# EAGLE design golia (EAGLE 8.1.1)
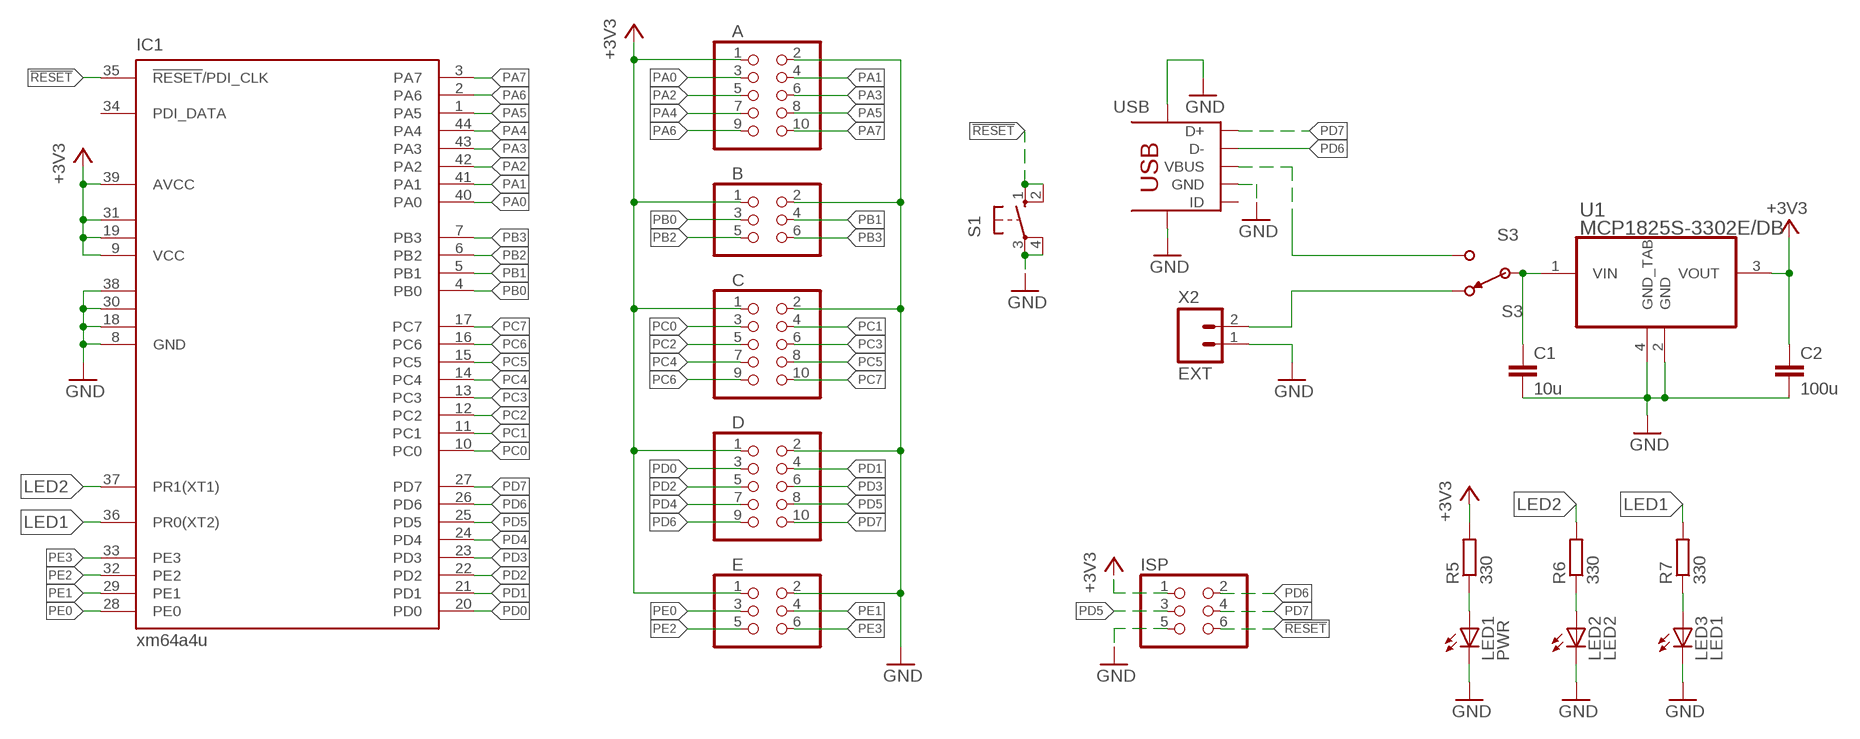
[diagram p0: schematic, sheet 1]

## Parts
A  PINHD-2X5  [2X05]
B  PINHD-2X3  [2X03]
C  PINHD-2X5  [2X05]
C1  10u  C0603  [C0603]
C2  100u  C-EUC1206  [C1206]
D  PINHD-2X5  [2X05]
E  PINHD-2X3  [2X03]
IC1  xm64a4u  XMEGA16A4A  [TQFP44]
ISP  PINHD-2X3  [2X03]
LED1  PWR  LEDCHIP-LED0805  [CHIP-LED0805]
LED2  LED2  LEDCHIP-LED0805  [CHIP-LED0805]
LED3  LED1  LEDCHIP-LED0805  [CHIP-LED0805]
R5  330  R-EU_R0603  [R0603]
R6  330  R-EU_R0603  [R0603]
R7  330  R-EU_R0603  [R0603]
S1  10-XX  [B3F-10XX]
S3  S3  SPDTEG-1218  [EG-1218]
U1  MCP1825S-3302E/DB  [SOT230P700X180-4N]
USB  USB-MINIB-PTH  [USB-MINIB-PTH]
X2  EXT  JST-22MM-PTH-VERT-LOCK  [JST-2-2MM-PTH-VERT-LOCK]

## Nets
!RESET: IC1.35(!RESET!/PDI_CLK) ISP.6 S1.1(S) S1.2(S1)
+3V3: A.1 B.1 C2.1 C.1 D.1 E.1 IC1.9(VCC) IC1.19(VCC1) IC1.31(VCC2) IC1.39(AVCC) ISP.1 R5.2 U1.3(VOUT)
GND: A.2 B.2 C1.2 C2.2 C.2 D.2 E.2 IC1.8(GND) IC1.18(GND1) IC1.30(GND2) IC1.38(GND3) ISP.5 LED1.C LED2.C LED3.C S1.3(P) S1.4(P1) U1.2(GND) U1.4(GND_TAB) USB.GND USB.P$6(SHD1) USB.P$7(SHD2) X2.1
LED1: IC1.36(PR0(XT2)) R7.2
LED2: IC1.37(PR1(XT1)) R6.2
N$1: S3.1 X2.2
N$2: S3.3 USB.VBUS
N$5: C1.1 S3.2(C) U1.1(VIN)
N$8: LED1.A R5.1
N$9: LED2.A R6.1
N$10: LED3.A R7.1
PA0: A.3 IC1.40(PA0)
PA1: A.4 IC1.41(PA1)
PA2: A.5 IC1.42(PA2)
PA3: A.6 IC1.43(PA3)
PA4: A.7 IC1.44(PA4)
PA5: A.8 IC1.1(PA5)
PA6: A.9 IC1.2(PA6)
PA7: A.10 IC1.3(PA7)
PB0: B.3 IC1.4(PB0)
PB1: B.4 IC1.5(PB1)
PB2: B.5 IC1.6(PB2)
PB3: B.6 IC1.7(PB3)
PC0: C.3 IC1.10(PC0)
PC1: C.4 IC1.11(PC1)
PC2: C.5 IC1.12(PC2)
PC3: C.6 IC1.13(PC3)
PC4: C.7 IC1.14(PC4)
PC5: C.8 IC1.15(PC5)
PC6: C.9 IC1.16(PC6)
PC7: C.10 IC1.17(PC7)
PD0: D.3 IC1.20(PD0)
PD1: D.4 IC1.21(PD1)
PD2: D.5 IC1.22(PD2)
PD3: D.6 IC1.23(PD3)
PD4: D.7 IC1.24(PD4)
PD5: D.8 IC1.25(PD5) ISP.3
PD6: D.9 IC1.26(PD6) ISP.2 USB.D-
PD7: D.10 IC1.27(PD7) ISP.4 USB.D+
PE0: E.3 IC1.28(PE0)
PE1: E.4 IC1.29(PE1)
PE2: E.5 IC1.32(PE2)
PE3: E.6 IC1.33(PE3)
Unconnected: IC1.34(PDI_DATA) USB.ID

## Library data of the parts
A C D = pinhead:PINHD-2X5: PIN HEADER
B E ISP = pinhead:PINHD-2X3: PIN HEADER
C1 = Passives:C; SUPPLIER: Onecall; TYPE: Capacitor
C2 = rcl:C-EU: CAPACITOR, European symbol
IC1 = atmel:XMEGA16A4: MICROCONTROLLER Features High-performance, Low-power 8/16-bit AVR XMEGA Microcontroller Non-Volatile Program and Data Memories - 16 KB - 128 KB of In-System Self-Programmable Flash - 4 KB - 8 KB Boot Code Section with Independent Lock Bits - 1 KB - 2 KB EEPROM - 2 KB - 8 KB Internal SRAM Peripheral Features - Four-channel DMA Controller with support for external requests - Eight-channel Event System - Five 16-bit Timer/Counters Three Timer/Counters with 4 Output Compare or Input Capture channels Two Timer/Counters with 2 Output Compare or Input Capture channels High-Resolution Extensions on all Timer/Counters Advanced Waveform Extension on one Timer/Counter - Five USARTs IrDA Extension on one USART - Two Two-Wire Interfaces with dual address match (I2C and SMBus compatible) - Two SPIs (Serial Peripheral Interfaces) peripherals - AES and DES Crypto Engine - 16-bit Real Time Counter with Separate Oscillator - One Twelve-channel, 12-bit, 2 Msps Analog to Digital Converter - One Two-channel, 12-bit, 1 Msps Digital to Analog Converter - Two Analog Comparators with Window compare function - External Interrupts on all General Purpose I/O pins - Programmable Watchdog Timer with Separate On-chip Ultra Low Power Oscillator Special Microcontroller Features - Power-on Reset and Programmable Brown-out Detection - Internal and External Clock Options with PLL - Programmable Multi-level Interrupt Controller - Sleep Modes: Idle, Power-down, Standby, Power-save, Extended Standby - Advanced Programming, Test and Debugging Interfaces PDI (Program and Debug Interface) for programming, test and debugging I/O and Packages - 34 Programmable I/O Lines - 44 - lead TQFP - 44 - pad VQFN/QFN - 49 - ball VFBGA Operating Voltage - 1.6 - 3.6V Speed performance - 0 - 12 MHz @ 1.6 - 3.6V - 0 - 32 MHz @ 2.7 - 3.6V Drawn by Dipl.-Ing. (FH) Robert Siegler Created: 27.05.09; OC_FARNELL: unknown; OC_NEWARK: unknown
LED1-LED3 = led:LED: LED OSRAM: - CHIPLED LG R971, LG N971, LY N971, LG Q971, LY Q971, LO R971, LY R971 LH N974, LH R974 LS Q976, LO Q976, LY Q976 LO Q996 - Hyper CHIPLED LW Q18S LB Q993, LB Q99A, LB R99A - SideLED LS A670, LO A670, LY A670, LG A670, LP A670 LB A673, LV A673, LT A673, LW A673 LH A674 LY A675 LS A676, LA A676, LO A676, LY A676, LW A676 LS A679, LY A679, LG A679 - Hyper Micro SIDELED® LS Y876, LA Y876, LO Y876, LY Y876 LT Y87S - SmartLED LW L88C, LW L88S LB L89C, LB L89S, LG L890 LS L89K, LO L89K, LY L89K LS L896, LA L896, LO L896, LY L896 - TOPLED LS T670, LO T670, LY T670, LG T670, LP T670 LSG T670, LSP T670, LSY T670, LOP T670, LYG T670 LG T671, LOG T671, LSG T671 LB T673, LV T673, LT T673, LW T673 LH T674 LS T676, LA T676, LO T676, LY T676, LB T676, LH T676, LSB T676, LW T676 LB T67C, LV T67C, LT T67C, LS T67K, LO T67K, LY T67K, LW E67C LS E67B, LA E67B, LO E67B, LY E67B, LB E67C, LV E67C, LT E67C LW T67C LS T679, LY T679, LG T679 LS T770, LO T770, LY T770, LG T770, LP T770 LB T773, LV T773, LT T773, LW T773 LH T774 LS E675, LA E675, LY E675, LS T675 LS T776, LA T776, LO T776, LY T776, LB T776 LHGB T686 LT T68C, LB T68C - Hyper Mini TOPLED® LB M676 - Mini TOPLED Santana® LG M470 LS M47K, LO M47K, LY M47K Source: http://www.osram.convergy.de LUXEON: - LUMILED® LXK2-PW12-R00, LXK2-PW12-S00, LXK2-PW14-U00, LXK2-PW14-V00 LXK2-PM12-R00, LXK2-PM12-S00, LXK2-PM14-U00 LXK2-PE12-Q00, LXK2-PE12-R00, LXK2-PE12-S00, LXK2-PE14-T00, LXK2-PE14-U00 LXK2-PB12-K00, LXK2-PB12-L00, LXK2-PB12-M00, LXK2-PB14-N00, LXK2-PB14-P00, LXK2-PB14-Q00 LXK2-PR12-L00, LXK2-PR12-M00, LXK2-PR14-Q00, LXK2-PR14-R00 LXK2-PD12-Q00, LXK2-PD12-R00, LXK2-PD12-S00 LXK2-PH12-R00, LXK2-PH12-S00 LXK2-PL12-P00, LXK2-PL12-Q00, LXK2-PL12-R00 Source: www.luxeon.com KINGBRIGHT: KA-3528ASYC Source: www.kingbright.com
R5-R7 = rcl:R-EU_: RESISTOR, European symbol
S1 = switch-omron:10-XX: OMRON SWITCH; MPN: B3F-1000; OC_FARNELL: 176432; OC_NEWARK: 36M3542
S3 = Switches:SPDT
U1 = mcp1825:MCP1825S-3302E/DB: IC, LDO VOLT REG, 3.3V, 0.5A; MPN: MCP1825S-3302E/DB; OC_FARNELL: 1578404; OC_NEWARK: 26M9961; PACKAGE: SOT-223-3; SUPPLIER: Microchip
USB = Connectors:USB-MINI
X2 = Connectors:JST-2

## Board
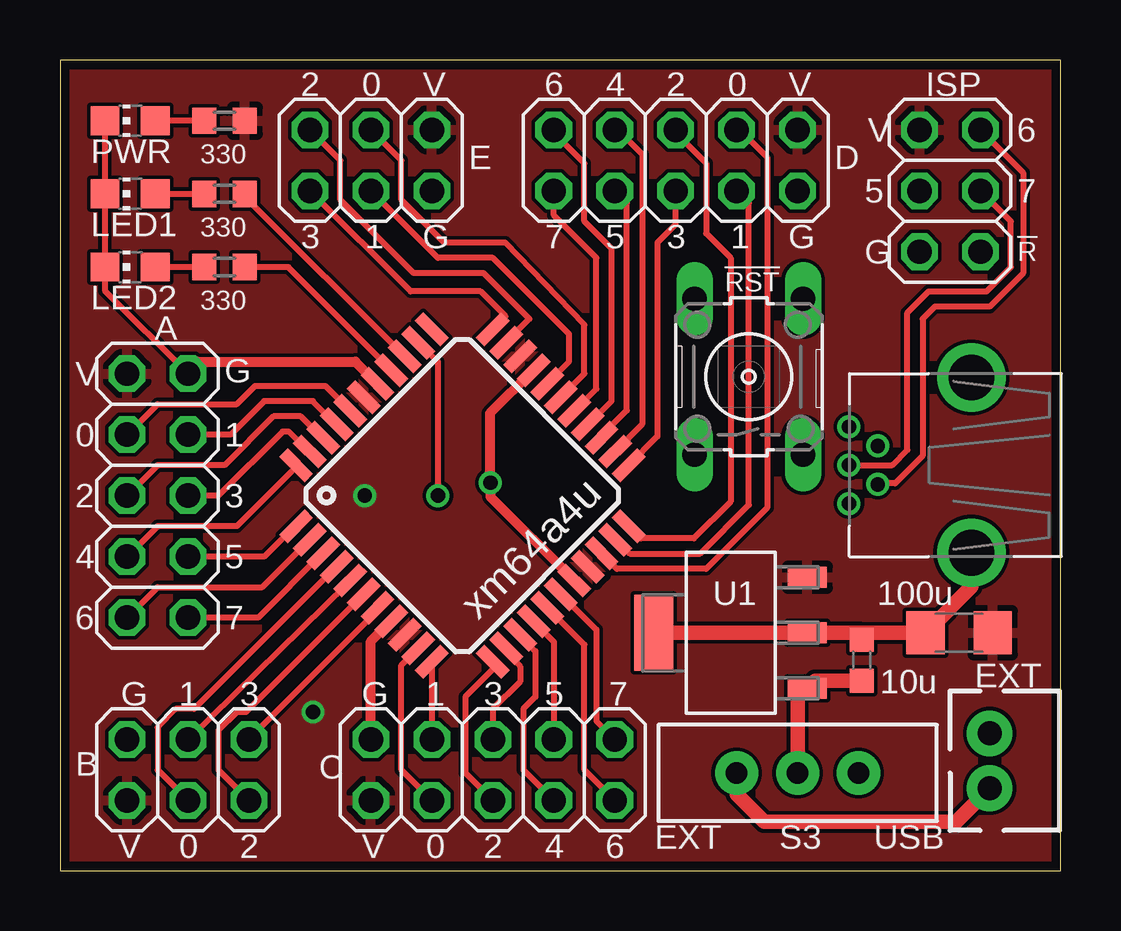
[diagram p1: board, top side]
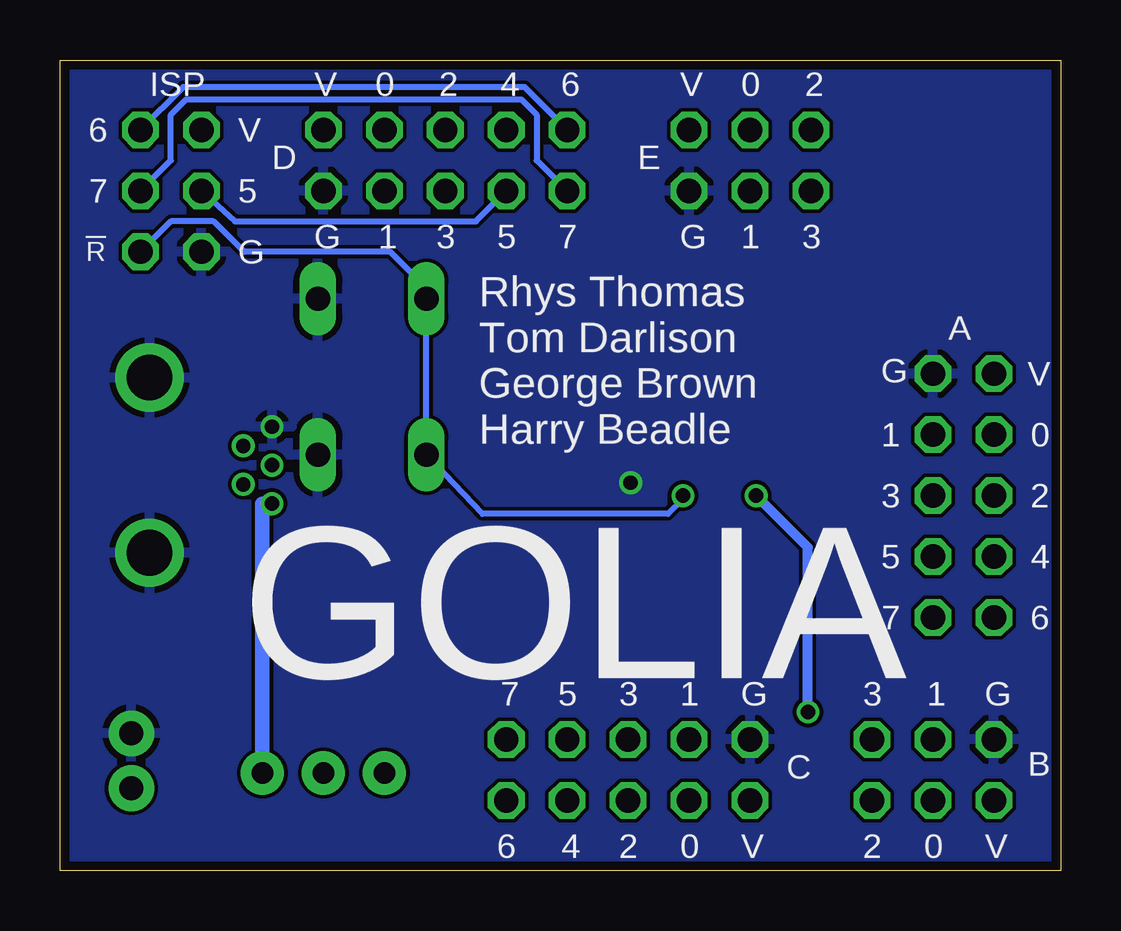
[diagram p2: board, bottom side, seen from below]

Size 41.71 x 33.77 mm. Coordinates in mm from the lower left corner, seen from the top.
Outline: 0,0 41.71,0 41.71,33.77 0,33.77 0,0
Copper layers (1*16): Top 0.0356mm / dielectric 1.5011mm / Bottom 0.0356mm
Design rules "LaenPCBOrder": minimum track width 6mil, minimum drill 13mil, track to track 6mil, track to pad 6mil, pad to pad 6mil, via to via 6mil, smd to smd 6mil, copper to edge 15mil, drill to drill 6mil, minimum pad ring 7mil, minimum via ring 7mil, stop-mask expansion 3mil, vias tented up to drill 0mil, thermal gap 10mil

### Footprints (pad centres in the part's own frame; a part is rotated, then mirrored left to right if it is on the bottom)
2X05 = drill 1.016 octagon: 1 -5.08,-1.27; 2 -5.08,1.27; 3 -2.54,-1.27; 4 -2.54,1.27; 5 0,-1.27; 6 0,1.27; 7 2.54,-1.27; 8 2.54,1.27; 9 5.08,-1.27; 10 5.08,1.27
2X03 = drill 1.016 octagon: 1 -2.54,-1.27; 2 -2.54,1.27; 3 0,-1.27; 4 0,1.27; 5 2.54,-1.27; 6 2.54,1.27
C0603 = smd 1 x 1: 1 -0.85,0; 2 0.85,0
C1206 = smd 1.6 x 1.8: 1 -1.4,0; 2 1.4,0
TQFP44 = smd 1.5 x 0.5: 1 -5.8,4; 2 -5.8,3.2; 3 -5.8,2.4; 4 -5.8,1.6; 5 -5.8,0.8; 6 -5.8,0; 7 -5.8,-0.8; 8 -5.8,-1.6; 9 -5.8,-2.4; 10 -5.8,-3.2; 11 -5.8,-4; 23 5.8,-4; 24 5.8,-3.2; 25 5.8,-2.4; 26 5.8,-1.6; 27 5.8,-0.8; 28 5.8,0; 29 5.8,0.8; 30 5.8,1.6; 31 5.8,2.4; 32 5.8,3.2; 33 5.8,4 | smd 0.5 x 1.5: 12 -4,-5.8; 13 -3.2,-5.8; 14 -2.4,-5.8; 15 -1.6,-5.8; 16 -0.8,-5.8; 17 0,-5.8; 18 0.8,-5.8; 19 1.6,-5.8; 20 2.4,-5.8; 21 3.2,-5.8; 22 4,-5.8; 34 4,5.8; 35 3.2,5.8; 36 2.4,5.8; 37 1.6,5.8; 38 0.8,5.8; 39 0,5.8; 40 -0.8,5.8; 41 -1.6,5.8; 42 -2.4,5.8; 43 -3.2,5.8; 44 -4,5.8
CHIP-LED0805 = smd 1.2 x 1.2: A 0,-1.05; C 0,1.05
R0603 = smd 1 x 1.1: 1 -0.85,0; 2 0.85,0
B3F-10XX = drill 1.016 long: 1 -3.251,2.261; 2 3.251,2.261; 3 -3.251,-2.261; 4 3.251,-2.261
EG-1218 = drill 0.9 pad 1.8: 1 0,2.54; 2 0,0; 3 0,-2.54
SOT230P700X180-4N = smd 1.626 x 0.889: 1 -3.2,2.311; 2 -3.2,0; 3 -3.2,-2.311 | smd 1.626 x 3.175: 4 3.2,0
USB-MINIB-PTH = drill 0.6: D+ 5.1,0; D- 3.9,0.8; GND 5.1,-1.6; ID 3.9,-0.8; VBUS 5.1,1.6 | drill 1.9: P$6 0,-3.65; P$7 0,3.65
JST-2-2MM-PTH-VERT-LOCK = drill 1 pad 1.9: 1 -1.143,0; 2 1.143,0

### Placement (x,y rotation side)
A  4.06,15.62 270 top
B  5.33,4.19 0 top
C  18.03,4.19 0 top
C1  33.4,8.76 90 top
C2  37.46,9.91 180 top
D  25.65,29.59 180 top
E  12.95,29.59 180 top
IC1  16.76,15.62 45 top
ISP  37.08,28.32 270 top
LED1  2.92,31.24 90 top
LED2  2.92,25.15 90 top
LED3  2.92,28.19 90 top
R5  6.86,31.24 0 top
R6  6.86,25.15 0 top
R7  6.86,28.19 0 top
S1  28.7,20.57 90 top
S3  30.73,4.06 90 top
U1  27.94,9.91 180 top
USB  37.97,16.89 180 top
X2  38.73,4.57 270 top

### Tracks (layer width: path | path; a pad name or v marks a point on that pad's centre or on a via)
!RESET  (via drill 0.6)
  Top 0.254: IC1.35 14.97,21.98 15.75,21.21 v15.75,15.62
  Bottom 0.254: v15.75,15.62 15.75,15.49 16.38,14.86 24.11,14.86 S1.1 S1.2 26.44,24.28 27.94,25.78 34.04,25.78 35.31,27.05 37.08,27.05 ISP.6
+3V3  (via drill 0.6)
  Bottom 0.406: v10.54,6.6 10.54,13.46 v12.7,15.62
  pour Top: 0,-0.13 0,33.78 41.91,33.78 41.91,-0.13
GND  (via drill 0.6)
  Top 0.254: IC1.38 13.11,20.29 | IC1.30 19.71,20.85 | 5.71,21.21 5.33,20.83 A.2 1.87,24.16 LED2.C LED3.C LED1.C
  Top 0.406: IC1.18 17.93,15.58 v17.93,16.16 17.91,16.18 17.91,19.05 19.71,20.85 | 5.71,21.21 12.31,21.21 IC1.38 | C.2 12.95,9.55 IC1.8
  Top 0.61: 33.4,9.91 C2.2 37.97,11.81 USB.P$7 | 33.4,9.91 U1.2 U1.4 | C1.2 33.4,9.91
  pour Bottom: 0,-0.13 0,33.78 41.91,33.78 41.91,-0.13
LED1
  Top 0.254: IC1.36 7.71,28.07 R7.2
LED2
  Top 0.254: IC1.37 9.53,25.12 9.53,25.15 R6.2
N$1
  Top 0.61: S3.1 28.19,3.17 29.34,2.03 37.34,2.03 X2.2
N$2
  Bottom 0.61: USB.VBUS 33.27,15.29 S3.3
N$5
  Top 0.61: S3.2 30.73,7.31 U1.1 31.46,7.91 C1.1
N$8
  Top 0.254: R5.1 LED1.A
N$9
  Top 0.254: R6.1 LED2.A
N$10
  Top 0.254: LED3.A R7.1
PA0
  Top 0.254: A.3 4.06,19.43 7.37,19.43 8.13,20.19 11.06,20.19 IC1.40
PA1
  Top 0.254: IC1.41 11.51,18.59 10.54,19.56 8.51,19.56 7.11,18.16 A.4
PA2
  Top 0.254: IC1.42 10.93,18.03 10.03,18.92 8.89,18.92 6.86,16.89 4.06,16.89 A.5
PA3
  Top 0.254: IC1.43 10.35,17.46 9.53,18.29 9.27,18.29 6.6,15.62 A.6
PA4
  Top 0.254: IC1.44 9.83,16.82 7.37,14.35 4.06,14.35 A.7
PA5
  Top 0.254: IC1.1 9.78,14.35 8.51,13.08 A.8
PA6
  Top 0.254: A.9 4.06,11.81 8.43,11.81 IC1.2
PA7
  Top 0.254: IC1.3 10.93,13.22 8.25,10.54 A.10
PB0
  Top 0.254: IC1.4 11.51,12.65 5.59,6.73 4.83,6.73 4.06,5.97 4.06,4.19 B.3
PB1
  Top 0.254: IC1.5 11.96,11.96 B.4
PB2
  Top 0.254: IC1.6 7.75,6.6 7.37,6.6 6.6,5.84 6.6,4.19 B.5
PB3
  Top 0.254: IC1.7 13.23,10.82 B.6
PC0
  Top 0.254: C.3 14.22,4.19 14.22,8.56 IC1.10
PC1
  Top 0.254: IC1.11 C.4
PC2
  Top 0.254: IC1.12 18.04,8.38 16.89,7.24 16.89,4.06 C.5
PC3
  Top 0.254: IC1.13 18.6,9.08 19.18,8.51 19.18,7.87 18.03,6.73 C.6
PC4
  Top 0.254: IC1.14 19.17,9.79 19.81,9.14 19.81,7.24 19.3,6.73 19.3,4.19 C.7
PC5
  Top 0.254: IC1.15 19.73,10.37 20.57,9.53 C.8
PC6
  Top 0.254: C.9 21.84,4.19 21.84,9.41 IC1.16
PC7
  Top 0.254: IC1.17 22.35,10.03 22.35,6.22 C.10
PD0
  Top 0.254: D.3 28.32,30.86 29.46,29.72 29.46,15.11 26.92,12.57 23.21,12.57 IC1.20
PD1
  Top 0.254: IC1.21 23.17,13.78 23.75,13.21 26.67,13.21 28.7,15.24 28.7,27.81 D.4
PD2
  Top 0.254: D.5 25.65,30.73 26.92,29.46 26.92,26.54 27.94,25.53 27.94,15.37 26.42,13.84 24.2,13.84 IC1.22
PD3
  Top 0.254: 23.69,16.96 IC1.23 24.89,18.09 24.89,26.16 25.65,26.92 D.6
PD4
  Top 0.254: 23.13,17.54 IC1.24 24.26,18.59 24.26,29.84 23.24,30.86 D.7
PD5
  Top 0.254: IC1.25 22.56,18.12 23.62,19.18 23.62,27.81 D.8
  Bottom 0.254: ISP.3 34.42,27.05 24.38,27.05 D.8
PD6
  Top 0.254: ISP.2 40.13,29.08 40.13,24.89 38.73,23.5 36.45,23.5 35.94,22.99 35.94,17.27 34.8,16.13 34.11,16.13 USB.D- | D.9 20.57,30.73 21.84,29.46 21.84,27.05 22.99,25.91 22.99,19.56 22.02,18.59 IC1.26
  Bottom 0.254: D.9 22.35,32.64 36.58,32.64 ISP.2
PD7
  Top 0.254: USB.D+ 34.67,16.89 35.31,17.53 35.31,23.24 36.2,24.13 38.61,24.13 39.62,25.15 39.62,27.05 ISP.4 | IC1.27 22.35,20.07 22.35,25.53 20.57,27.3 D.10
  Bottom 0.254: ISP.4 37.08,29.59 37.08,31.5 36.45,32.13 22.48,32.13 21.84,31.5 21.84,29.59 D.10
PE0
  Top 0.254: IC1.28 21.84,20.7 21.84,22.73 18.54,26.16 16,26.16 14.22,27.94 14.22,29.59 E.3
PE1
  Top 0.254: IC1.29 21.21,21.21 21.21,22.35 18.03,25.53 15.75,25.53 E.4
PE2
  Top 0.254: IC1.32 18.6,22.03 19.56,22.99 17.65,24.89 14.73,24.89 11.68,27.94 11.68,29.59 E.5
PE3
  Top 0.254: 18.04,22.6 IC1.33 18.54,23.06 18.54,23.11 17.53,24.13 14.61,24.13 E.6

### Text on the board
tNames: 2 | 0 | V | 6 | 4 | 2 | 0 | V | V | 6 | 5 | 7 | 3 | 1 | G | 7 | 5 | 3 | 1 | G | G | !R | !RST | G | V | 0 | 1 | 2 | 3 | 4 | 5 | 6 | 7 | EXT | G | 1 | 3 | G | 1 | 3 | 5 | 7 | V | 0 | 2 | V | 0 | 2 | 4 | 6 | EXT | USB
bNames: 2 | 0 | V | 6 | 4 | 2 | 0 | V | ISP | V | 6 | E | D | 5 | 7 | 3 | 1 | G | 7 | 5 | 3 | 1 | G | G | !R | A | G | V | 0 | 1 | Rhys Thomas / Tom Darlison / George Brown / Harry Beadle | 2 | 3 | 4 | 5 | 6 | 7 | GOLIA | G | 1 | 3 | G | 1 | 3 | 5 | 7 | B | C | V | 0 | 2 | V | 0 | 2 | 4 | 6